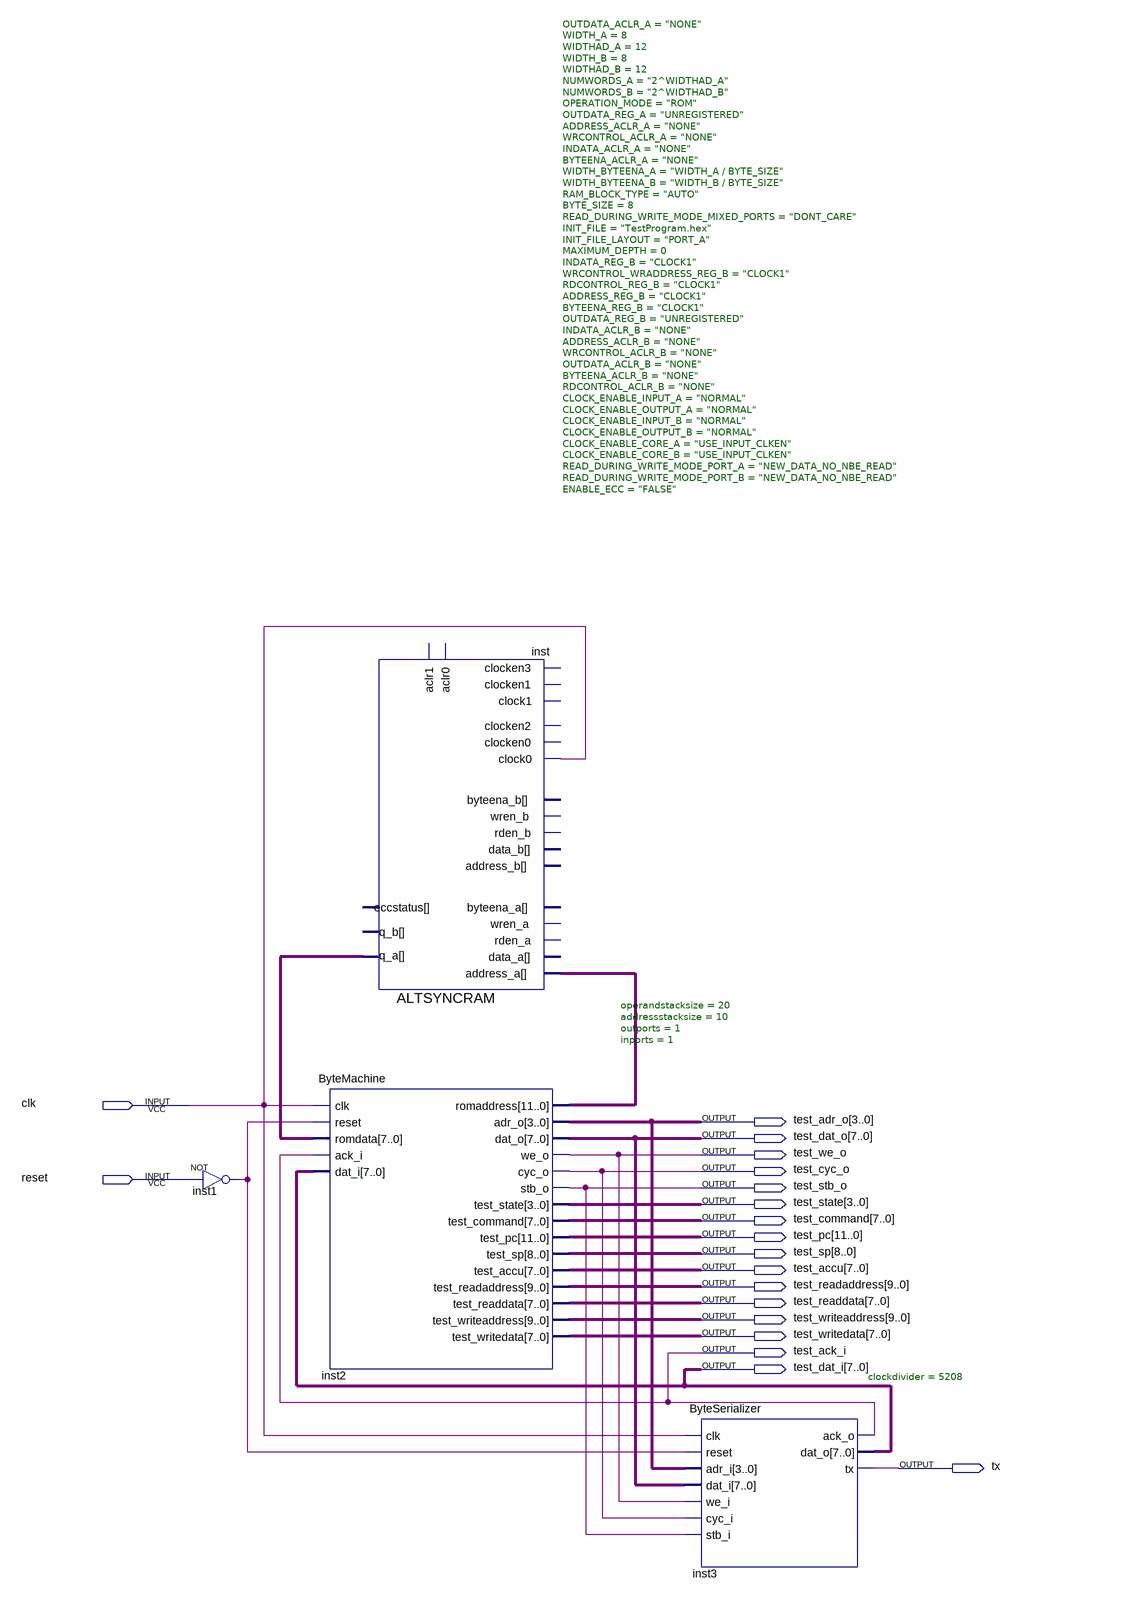
[diagram p0: schematic sheet]
// Quartus schematic ByteSystem.bdf as structural Verilog: 4 symbols, 19 pins
module ByteSystem (
  input  clk,
  input  reset,
  output [3:0] test_adr_o,
  output [7:0] test_dat_o,
  output test_we_o,
  output test_cyc_o,
  output test_stb_o,
  output [3:0] test_state,
  output [7:0] test_command,
  output [11:0] test_pc,
  output [8:0] test_sp,
  output [7:0] test_accu,
  output [9:0] test_readaddress,
  output [7:0] test_readdata,
  output [9:0] test_writeaddress,
  output [7:0] test_writedata,
  output test_ack_i,
  output [7:0] test_dat_i,
  output tx
);

  wire inst1_out;
  wire [7:0] inst_q_a;
  wire [11:0] inst2_romaddress;

  not inst1 (inst1_out, reset);
  ALTSYNCRAM #(.OUTDATA_ACLR_A("NONE"), .WIDTH_A(8), .WIDTHAD_A(12), .WIDTH_B(8), .WIDTHAD_B(12), .NUMWORDS_A("2^WIDTHAD_A"), .NUMWORDS_B("2^WIDTHAD_B"), .OPERATION_MODE("ROM"), .OUTDATA_REG_A("UNREGISTERED"), .ADDRESS_ACLR_A("NONE"), .WRCONTROL_ACLR_A("NONE"), .INDATA_ACLR_A("NONE"), .BYTEENA_ACLR_A("NONE"), .WIDTH_BYTEENA_A("WIDTH_A / BYTE_SIZE"), .WIDTH_BYTEENA_B("WIDTH_B / BYTE_SIZE"), .RAM_BLOCK_TYPE("AUTO"), .BYTE_SIZE(8), .READ_DURING_WRITE_MODE_MIXED_PORTS("DONT_CARE"), .INIT_FILE("TestProgram.hex"), .INIT_FILE_LAYOUT("PORT_A"), .MAXIMUM_DEPTH(0), .INDATA_REG_B("CLOCK1"), .WRCONTROL_WRADDRESS_REG_B("CLOCK1"), .RDCONTROL_REG_B("CLOCK1"), .ADDRESS_REG_B("CLOCK1"), .BYTEENA_REG_B("CLOCK1"), .OUTDATA_REG_B("UNREGISTERED"), .INDATA_ACLR_B("NONE"), .ADDRESS_ACLR_B("NONE"), .WRCONTROL_ACLR_B("NONE"), .OUTDATA_ACLR_B("NONE"), .BYTEENA_ACLR_B("NONE"), .RDCONTROL_ACLR_B("NONE"), .CLOCK_ENABLE_INPUT_A("NORMAL"), .CLOCK_ENABLE_OUTPUT_A("NORMAL"), .CLOCK_ENABLE_INPUT_B("NORMAL"), .CLOCK_ENABLE_OUTPUT_B("NORMAL"), .CLOCK_ENABLE_CORE_A("USE_INPUT_CLKEN"), .CLOCK_ENABLE_CORE_B("USE_INPUT_CLKEN"), .READ_DURING_WRITE_MODE_PORT_A("NEW_DATA_NO_NBE_READ"), .READ_DURING_WRITE_MODE_PORT_B("NEW_DATA_NO_NBE_READ"), .ENABLE_ECC("FALSE")) inst (
    .address_a(inst2_romaddress), .clock0(clk), .q_a(inst_q_a));  // open: wren_a, byteena_a, data_b, rden_b, wren_b, byteena_b, clocken0, clock1, clocken1, aclr0, aclr1, data_a, address_b, clocken3, clocken2, rden_a, q_b, eccstatus
  ByteMachine #(.operandstacksize(20), .addressstacksize(10), .outports(1), .inports(1)) inst2 (
    .clk(clk), .reset(inst1_out), .romdata(inst_q_a), .ack_i(test_ack_i), .dat_i(test_dat_i),
    .romaddress(inst2_romaddress), .adr_o(test_adr_o), .dat_o(test_dat_o), .we_o(test_we_o),
    .cyc_o(test_cyc_o), .stb_o(test_stb_o), .test_state(test_state), .test_command(test_command),
    .test_pc(test_pc), .test_sp(test_sp), .test_accu(test_accu), .test_readaddress(test_readaddress),
    .test_readdata(test_readdata), .test_writeaddress(test_writeaddress), .test_writedata(test_writedata));
  ByteSerializer #(.clockdivider(5208)) inst3 (
    .clk(clk), .reset(inst1_out), .adr_i(test_adr_o), .dat_i(test_dat_o), .we_i(test_we_o),
    .cyc_i(test_cyc_o), .stb_i(test_stb_o), .ack_o(test_ack_i), .dat_o(test_dat_i), .tx(tx));
endmodule
